# EAGLE design Sled_Terminals_v1 (EAGLE 9.6.2)
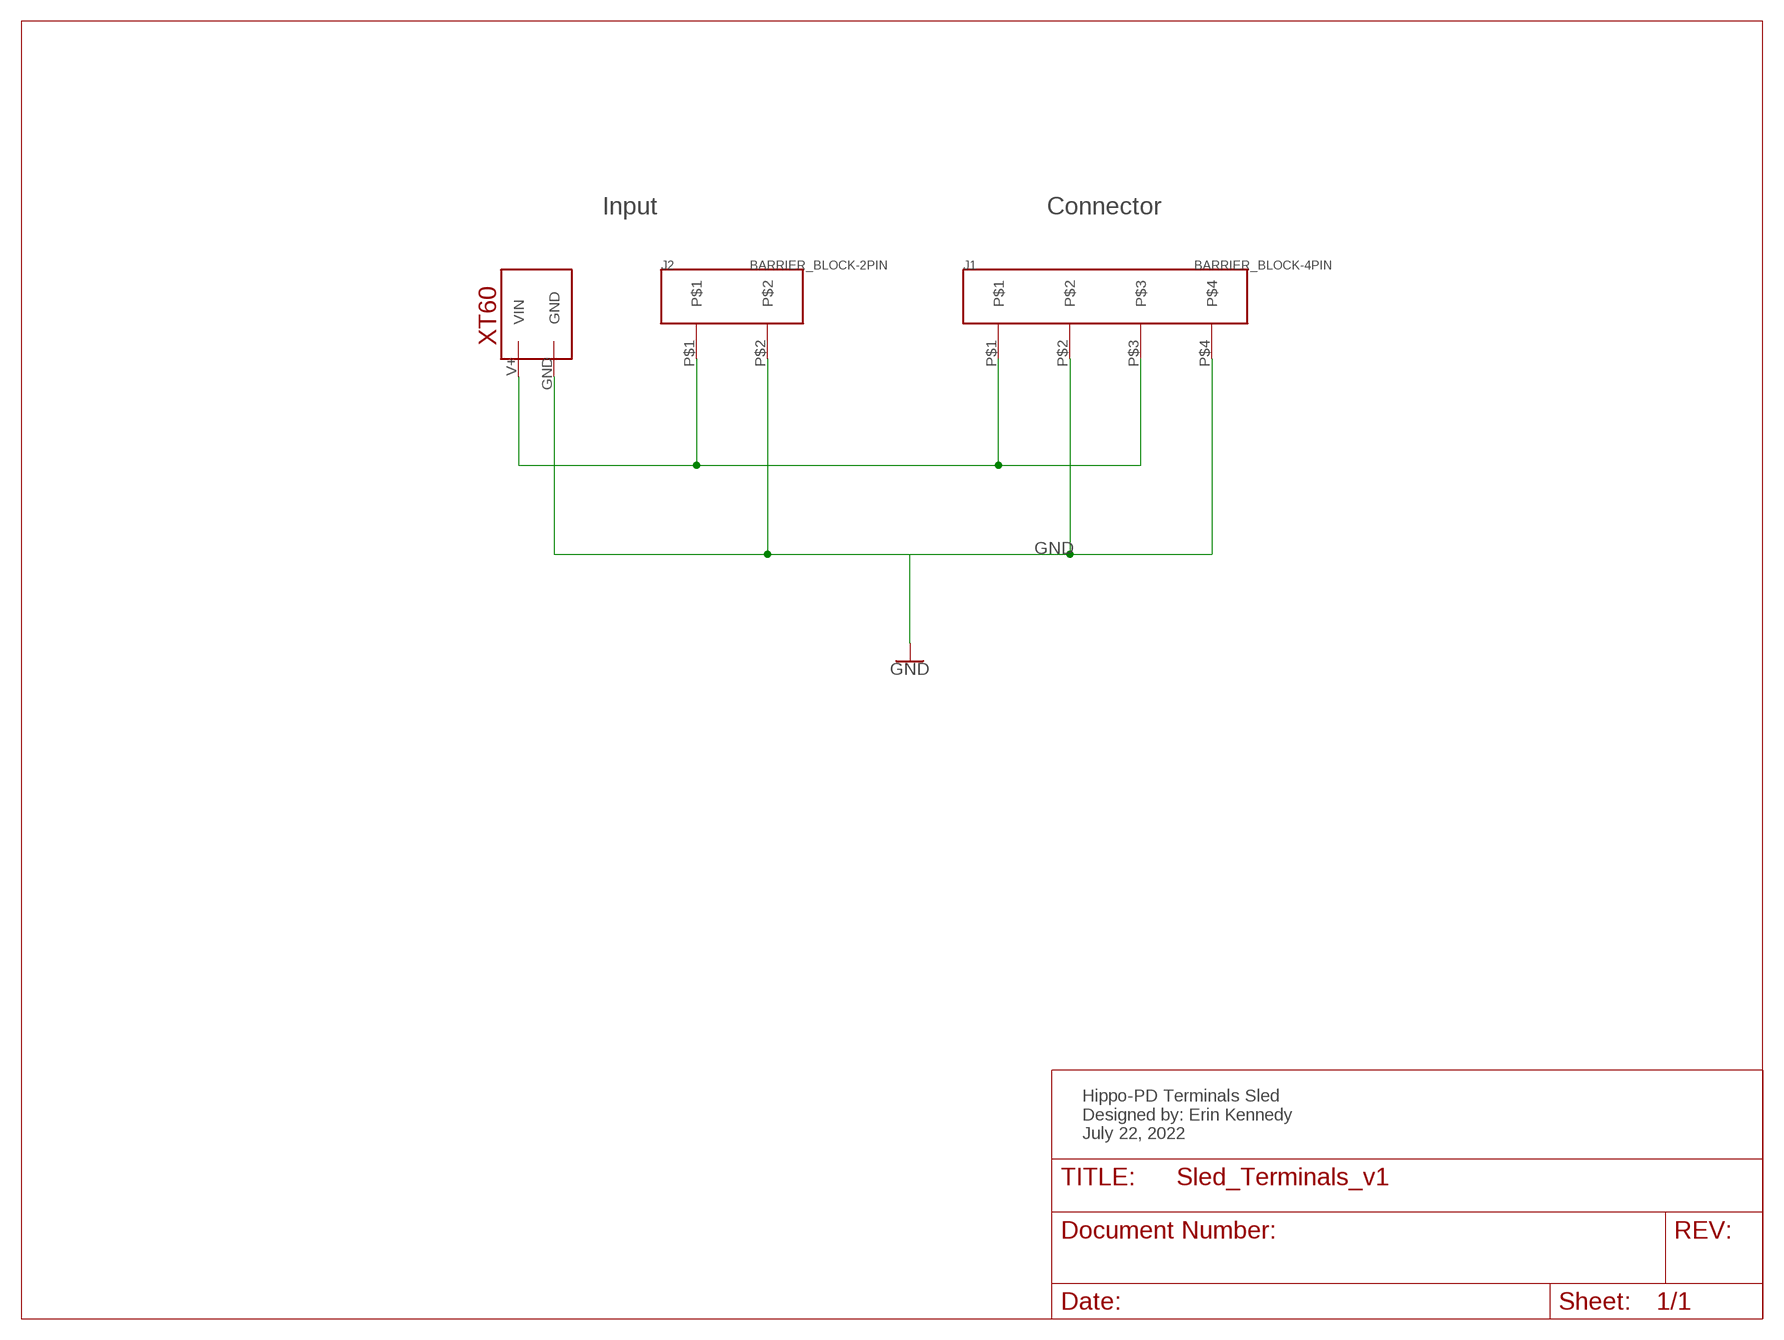
[diagram p0: schematic, sheet 1]

## Parts
J1  BARRIER_BLOCK-4PIN  [BARRIERBLOCK-4PIN]
J2  BARRIER_BLOCK-2PIN  [BARRIERBLOCK-2PIN]
U$1  XT60  [XT60]

## Nets
GND: J1.P$2 J1.P$4 J2.P$2 U$1.GND
N$1: J1.P$1 J1.P$3 J2.P$1 U$1.V+(VIN)

## Notes on the sheet
- Input | Connector
- Hippo-PD Terminals Sled
  Designed by: Erin Kennedy
  July 22, 2022

## Library data of the parts
J1 = Hippo-PS:BARRIER_BLOCK-4PIN: Barrier block connector Digikey #ED2946-ND
J2 = Hippo-PS:BARRIER_BLOCK-2PIN: Barrier block connector Digikey #ED2946-ND
U$1 = Hippo-PS:XT60: XT60

## Board
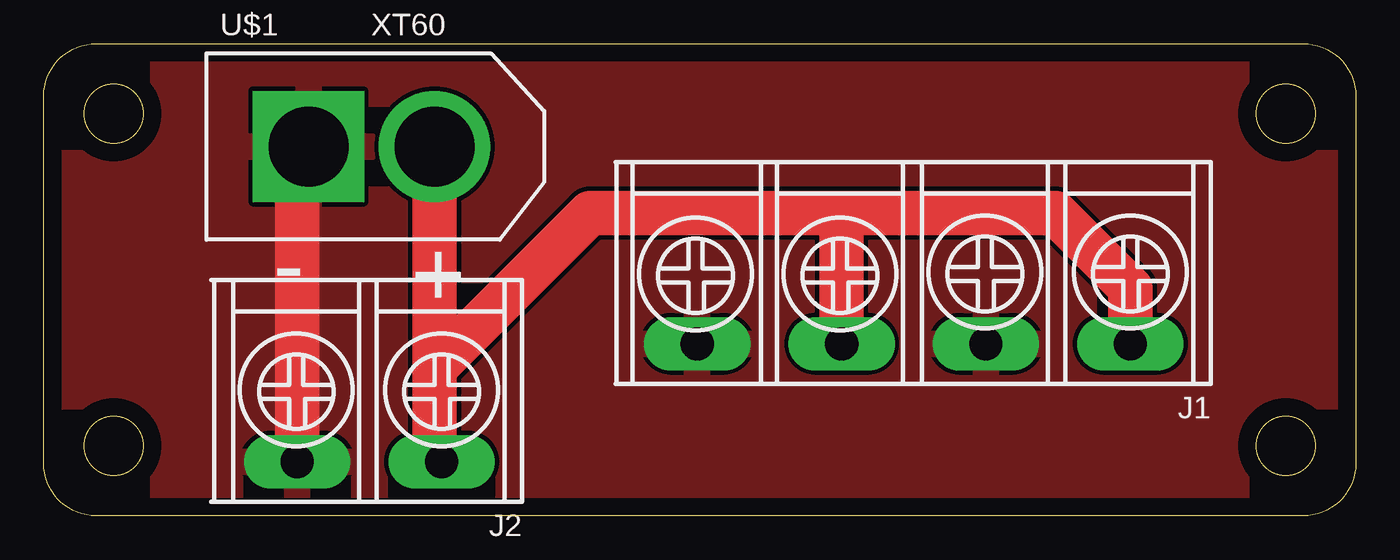
[diagram p1: board, top side]
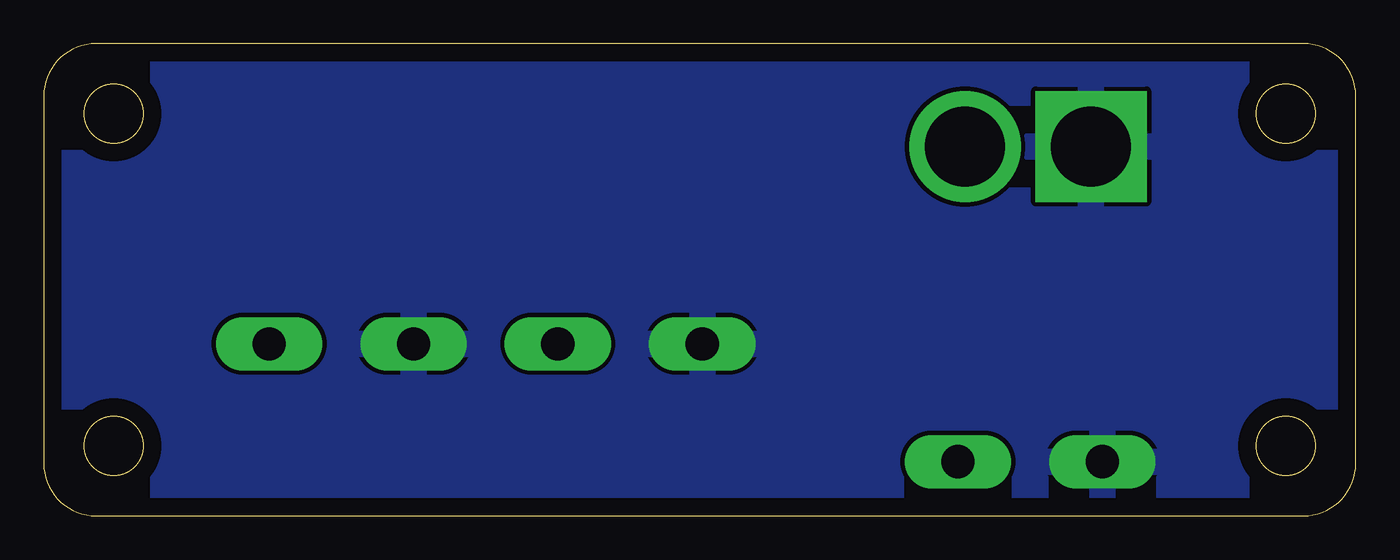
[diagram p2: board, bottom side, seen from below]

Size 75 x 27 mm. Coordinates in mm from the lower left corner, seen from the top.
Outline: 75,3 arc-90 72,0 3,0 arc-90 0,3 0,24 arc-90 3,27 72,27 arc-90 75,24 75,3
Outline: circle at 4,4 radius 1.7
Outline: circle at 71,23 radius 1.7
Outline: circle at 4,23 radius 1.7
Outline: circle at 71,4 radius 1.7
Copper layers (1*16): Top 0.035mm / dielectric 1.5mm / Bottom 0.035mm
Design rules "default *": minimum track width 8mil, minimum drill 0.35mm, track to track 10mil, track to pad 10mil, pad to pad 10mil, via to via 10mil, smd to smd 10mil, copper to edge 40mil, drill to drill 10mil, minimum pad ring 10mil, minimum via ring 8mil, stop-mask expansion 4mil, vias tented up to drill 0mil, thermal gap 10mil

### Footprints (pad centres in the part's own frame; a part is rotated, then mirrored left to right if it is on the bottom)
BARRIERBLOCK-4PIN = drill 1.905 pad 3.048 long: P$1 4.6,10.4; P$2 12.85,10.4; P$3 21.1,10.4; P$4 29.355,10.4
BARRIERBLOCK-2PIN = drill 1.905 pad 3.048 long: P$1 4.6,10.4; P$2 12.85,10.4
XT60 = drill 4.572 pad 6.35 square: GND 4.3,0 | drill 4.572 pad 6.35: V+ 11.5,0

### Placement (x,y rotation side)
J1  66.71,20.23 180 top
J2  27.34,13.5 180 top
U$1  10.83,21.12 0 top

### Tracks (layer width: path | path; a pad name or v marks a point on that pad's centre or on a via)
GND
  Top 2.54: U$1.GND 14.49,20.48 J2.P$2
  pour Top: -4.41,32.55 79.41,32.55 79.41,-4.28 -4.41,-4.28
  pour Bottom: -5.68,35.09 81.95,35.09 81.95,-6.82 -6.95,-6.82 -6.95,35.09
N$1
  Top 2.54: U$1.V+ 22.33,8.42 | 22.33,8.42 22.33,3.51 J2.P$1 | 22.33,8.42 31.22,17.31 45.12,17.31 | 45.12,17.31 57.82,17.31 62.11,13.02 J1.P$1 | J1.P$3 45.61,16.82 45.12,17.31

### Text on the board
tNames: word